# Altium project Control_Board.PrjPcb (part 3 of 7)

## Sheet Gate_Driver.SchDoc
size A4; SheetNumber: 5; SheetTotal: 9
Used 3 times, as channels GD1, GD2, GD3. Parts and nets are listed once, with the designators drawn on the sheet.
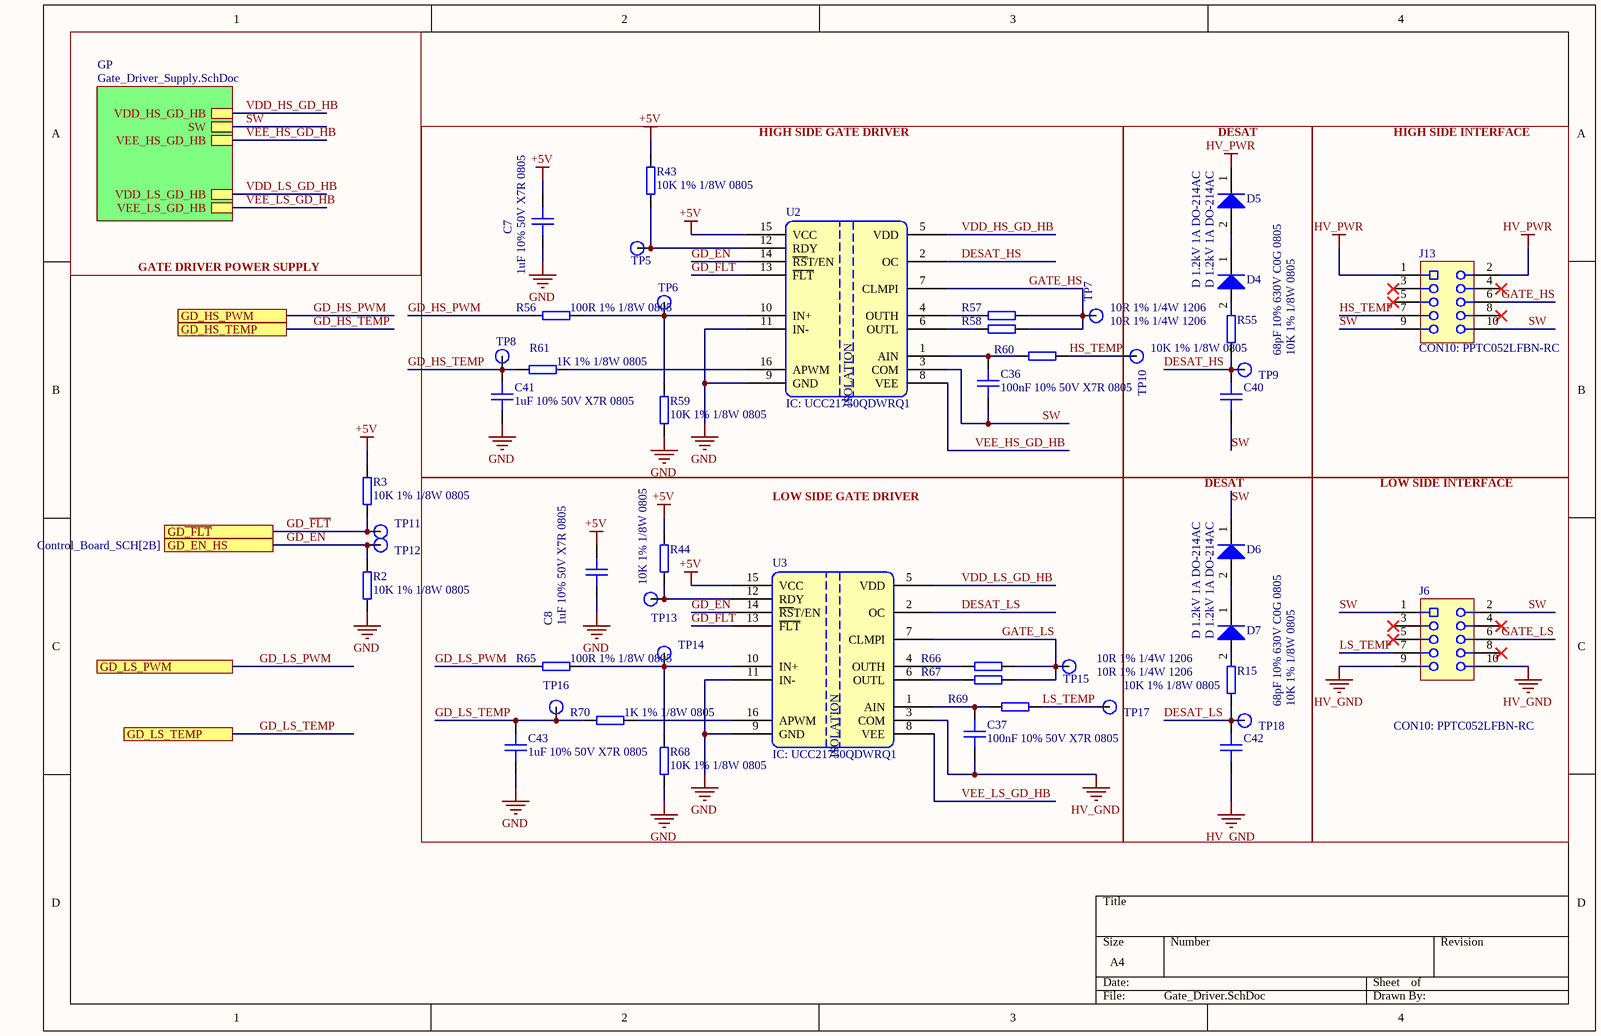
[diagram p3: Gate_Driver.SchDoc]

### Parts
C7  1uF 10% 50V X7R 0805  [CAPC2012X10N]
C8  1uF 10% 50V X7R 0805  [CAPC2012X10N]
C36  100nF 10% 50V X7R 0805  [CAPC2012X10N]
C37  100nF 10% 50V X7R 0805  [CAPC2012X10N]
C40  68pF 10% 630V C0G 0805  [CAPC2012X10N]
C41  1uF 10% 50V X7R 0805  [CAPC2012X10N]
C42  68pF 10% 630V C0G 0805  [CAPC2012X10N]
C43  1uF 10% 50V X7R 0805  [CAPC2012X10N]
D4  D 1.2kV 1A DO-214AC  [FP-95400-MFG]
D5  D 1.2kV 1A DO-214AC  [FP-95400-MFG]
D6  D 1.2kV 1A DO-214AC  [FP-95400-MFG]
D7  D 1.2kV 1A DO-214AC  [FP-95400-MFG]
J6  CON10: PPTC052LFBN-RC  [SLIN-PPTC052LFBN-RC_V]
J13  CON10: PPTC052LFBN-RC  [SLIN-PPTC052LFBN-RC_V]
R2  10K 1% 1/8W 0805  [RESC2012X05N]
R3  10K 1% 1/8W 0805  [RESC2012X05N]
R15  10K 1% 1/8W 0805  [RESC2012X05N]
R43  10K 1% 1/8W 0805  [RESC2012X05N]
R44  10K 1% 1/8W 0805  [RESC2012X05N]
R55  10K 1% 1/8W 0805  [RESC2012X05N]
R56  100R 1% 1/8W 0805  [RESC2012X05N]
R57  10R 1% 1/4W 1206  [RESC3116X06N]
R58  10R 1% 1/4W 1206  [RESC3116X06N]
R59  10K 1% 1/8W 0805  [RESC2012X05N]
R60  10K 1% 1/8W 0805  [RESC2012X05N]
R61  1K 1% 1/8W 0805  [RESC2012X05N]
R65  100R 1% 1/8W 0805  [RESC2012X05N]
R66  10R 1% 1/4W 1206  [RESC3116X06N]
R67  10R 1% 1/4W 1206  [RESC3116X06N]
R68  10K 1% 1/8W 0805  [RESC2012X05N]
R69  10K 1% 1/8W 0805  [RESC2012X05N]
R70  1K 1% 1/8W 0805  [RESC2012X05N]
TP5  TestPoint  [Test Point-Footprint-1]  (value not drawn)
TP6  TestPoint  [Test Point-Footprint-1]  (value not drawn)
TP7  TestPoint  [Test Point-Footprint-1]  (value not drawn)
TP8  TestPoint  [Test Point-Footprint-1]  (value not drawn)
TP9  TestPoint  [Test Point-Footprint-1]  (value not drawn)
TP10  TestPoint  [Test Point-Footprint-1]  (value not drawn)
TP11  TestPoint  [Test Point-Footprint-1]  (value not drawn)
TP12  TestPoint  [Test Point-Footprint-1]  (value not drawn)
TP13  TestPoint  [Test Point-Footprint-1]  (value not drawn)
TP14  TestPoint  [Test Point-Footprint-1]  (value not drawn)
TP15  TestPoint  [Test Point-Footprint-1]  (value not drawn)
TP16  TestPoint  [Test Point-Footprint-1]  (value not drawn)
TP17  TestPoint  [Test Point-Footprint-1]  (value not drawn)
TP18  TestPoint  [Test Point-Footprint-1]  (value not drawn)
U2  IC: UCC21750QDWRQ1  [SOIC127P1030X265-16N]
U3  IC: UCC21750QDWRQ1  [SOIC127P1030X265-16N]

### Blocks framed on the sheet
HIGH SIDE GATE DRIVER: C7 C36 C41 R43 R56-R61 TP5-TP8 U2
DESAT: C40 D4 D5 R55 TP9 TP10
HIGH SIDE INTERFACE: J13
LOW SIDE GATE DRIVER: C8 C37 C43 R44 R65-R70 TP13-TP17 U3
DESAT: C42 D6 D7 R15 TP18
LOW SIDE INTERFACE: J6

### Sub-sheets
GP = Gate_Driver_Supply.SchDoc: VDD_HS_GD_HB, SW, VEE_HS_GD_HB, VDD_LS_GD_HB, VEE_LS_GD_HB

### Ports
GD_EN_HS (see Control_Board_SCH[2B]), GD_HS_PWM (see Control_Board_SCH[2B]), GD_HS_TEMP (see Control_Board_SCH[2B]), GD_LS_PWM (see Control_Board_SCH[2C]), GD_LS_TEMP (see Control_Board_SCH[2C]), GD~{_FLT} (see Control_Board_SCH[2B])

### Nets
+5V: C7.2 C8.2 R3.2 R43.2 R44.2 U2.15(VCC) U3.15(VCC)
GND: C7.1 C8.1 C41.1 C43.1 R2.1 R59.1 R68.1 U2.9(GND) U2.11(IN-) U3.9(GND) U3.11(IN-)
HV_GND: C37.2 C42.1 J6.9 J6.10 U3.3(COM)
HV_PWR: D5.1(K) J13.1 J13.2
DESAT_HS: C40.2 R55.1 TP9.1 U2.2(OC)
DESAT_LS: C42.2 R15.1 TP18.1 U3.2(OC)
GATE_HS: J13.6 R57.2 R58.2 TP7.1 U2.7(CLMPI)
GATE_LS: J6.6 R66.2 R67.2 TP15.1 U3.7(CLMPI)
GD_EN: R2.2 TP12.1 U2.14(~{RS}T/EN) U3.14(~{RS}T/EN) ; port GD_EN_HS
GD_~{FLT}: R3.1 TP11.1 U2.13(~{FLT}) U3.13(~{FLT}) ; port GD~{_FLT}
GD_HS_PWM: R56.1 ; port GD_HS_PWM
GD_HS_TEMP: C41.2 R61.1 TP8.1 ; port GD_HS_TEMP
GD_LS_PWM: R65.1 ; port GD_LS_PWM
GD_LS_TEMP: C43.2 R70.1 TP16.1 ; port GD_LS_TEMP
HS_TEMP: J13.7 R60.2 TP10.1
LS_TEMP: J6.7 R69.2 TP17.1
SW: C36.2 C40.1 D6.1(K) J6.1 J6.2 J13.9 J13.10 U2.3(COM) ; sheet GP/SW
VDD_HS_GD_HB: U2.5(VDD) ; sheet GP/VDD_HS_GD_HB
VDD_LS_GD_HB: U3.5(VDD) ; sheet GP/VDD_LS_GD_HB
VEE_HS_GD_HB: U2.8(VEE) ; sheet GP/VEE_HS_GD_HB
VEE_LS_GD_HB: U3.8(VEE) ; sheet GP/VEE_LS_GD_HB
NetC36_1: C36.1 R60.1 U2.1(AIN)
NetC37_1: C37.1 R69.1 U3.1(AIN)
NetD4_1: D4.1(K) D5.2(A)
NetD4_2: D4.2(A) R55.2
NetD6_2: D6.2(A) D7.1(K)
NetD7_2: D7.2(A) R15.2
NetR43_1: R43.1 TP5.1 U2.12(RDY)
NetR44_1: R44.1 TP13.1 U3.12(RDY)
NetR56_2: R56.2 R59.2 TP6.1 U2.10(IN+)
NetR57_1: R57.1 U2.4(OUTH)
NetR58_1: R58.1 U2.6(OUTL)
NetR61_2: R61.2 U2.16(APWM)
NetR65_2: R65.2 R68.2 TP14.1 U3.10(IN+)
NetR66_1: R66.1 U3.4(OUTH)
NetR67_1: R67.1 U3.6(OUTL)
NetR70_2: R70.2 U3.16(APWM)

Not connected (* = marked no-connect by the designer): J6 3* 4* 5* 8*; J13 3* 4* 5* 8*

### Channels
GD1: designators end in _GD1; ports GD_EN_HS=GD_EN GD_HS_PWM=GD_HS_PWM GD_HS_TEMP=GD_HS_TEMP GD_LS_PWM=GD_LS_PWM GD_LS_TEMP=GD_LS_TEMP GD~{_FLT}=GD~{_FLT}1
GD2: designators end in _GD2; ports GD_EN_HS=GD_EN GD_HS_PWM=GD_HS_PWM GD_HS_TEMP=GD_HS_TEMP GD_LS_PWM=GD_LS_PWM GD_LS_TEMP=GD_LS_TEMP GD~{_FLT}=GD~{_FLT}2
GD3: designators end in _GD3; ports GD_EN_HS=GD_EN GD_HS_PWM=GD_HS_PWM GD_HS_TEMP=GD_HS_TEMP GD_LS_PWM=GD_LS_PWM GD_LS_TEMP=GD_LS_TEMP GD~{_FLT}=GD~{_FLT}3

### Notes on the sheet
- GATE DRIVER POWER SUPPLY
- (in symbol CMP-309-000001-3) ISOLATION

### Library data of the parts
C7 C8 C41 C43 = CMP-001-00047-1: Ceramic Capacitor, Multilayer, Ceramic, 50V, 10% +Tol, 10% -Tol, X7R, 15% TC, 1uF, Surface Mount, 0805; Manufacturer Part Number: C2012X7R1H105K125AB; Manufacturer Lifecycle Status: PRODUCTION; Manufacturer: TDK; Value: 1µF; Export Control Classification Number (ECCN) Code: EAR99; Case/Package: 0805; Max Length: 3.5mm; ComponentLink4Description: https://datasheet.octopart.com:443/C3216X7R1H106K160AC-TDK-datasheet-151546523.pdf?src-supplier=ODG+(Origin+Data+Global); ComponentLink1URL: https://datasheet.octopart.com:443/C3216X7R1H106K160AC-TDK-datasheet-175423548.pdf?src-supplier=TME; Category: Ceramic Capacitors; Voltage Rating (DC): 50V; Case Code (Metric): 2012; Lifecycle Status: Production; Height: 1.6mm; Design Item ID: 1uF 10% 50V X7R 0805; Min Length: 3.1mm; Min Operating Temperature: -55°C; Pricing: 100=3,09, 250=2,81, 500=2,35, 1000=2,2, 2000=1,97 (DKK); Width: 1.6mm; Voltage Rating: 50V; Stock: 26276; ComponentLink2Description: https://datasheet.octopart.com:443/C3216X7R1H106K160AC-TDK-datasheet-182135025.pdf?src-supplier=TME; Harmonized Tariff Schedule (HTS) Code: 8532.24.00.20; ComponentLink3Description: https://datasheet.octopart.com:443/C3216X7R1H106K160AC-TDK-datasheet-159617022.pdf?src-supplier=TME; Thickness: 1.6mm; Max Operating Temperature: 125°C; ComponentLink4URL: https://datasheet.octopart.com:443/C3216X7R1H106K160AC-TDK-datasheet-151546523.pdf?src-supplier=ODG+(Origin+Data+Global); Lead Free: Lead Free; ComponentLink3URL: https://datasheet.octopart.com:443/C3216X7R1H106K160AC-TDK-datasheet-159617022.pdf?src-supplier=TME; ComponentLink1Description: https://datasheet.octopart.com:443/C3216X7R1H106K160AC-TDK-datasheet-175423548.pdf?src-supplier=TME; Max Width: 1.9mm; Dielectric: X7R; RoHS: Compliant; China RoHS: Compliant; REACH SVHC: Yes; ComponentLink2URL: https://datasheet.octopart.com:443/C3216X7R1H106K160AC-TDK-datasheet-182135025.pdf?src-supplier=TME; Length: 3.2mm; ComponentLink5URL: https://datasheet.octopart.com/C3216X7R1H106K160AC-TDK-datasheet-41194876.pdf; Introduction Date: 2018-03-29; Dielectric Material: Ceramic; Min Width: 1.5mm; Number of Terminals: 2; Material: Ceramic; Source: MasterLibrary_SCH.SchLib; Mounting Technology: Surface Mount; ComponentLink5Description: https://datasheet.octopart.com/C3216X7R1H106K160AC-TDK-datasheet-41194876.pdf
C36 C37 = CMP-001-00091-1: Multilayer Ceramic Capacitors MLCC - SMD/SMT 50V 0.1uF X7R 0805 10%; Manufacturer: Stackpole Electronics; Manufacturer Part Number: CML0805X7R104KT50V; Voltage Rating (DC): 50V; REACH SVHC: Yes; Height: 800µm; Min Operating Temperature: -55°C; Dielectric Material: Ceramic; RoHS: Compliant; Number of Terminals: 2; Lifecycle Status: Production; Width: 1.25mm; Length: 2mm; Category: Ceramic Capacitors; Max Operating Temperature: 125°C; Mount: Surface Mount; Capacitance: 100nF
C40 C42 = CMP-001-00086-1: Ceramic Capacitor, Multilayer, Ceramic, 630V, 5% +Tol, 5% -Tol, C0G, 30ppm/Cel TC, 6.8e-05uF, Surface Mount, 0805; Manufacturer: KEMET; Manufacturer Part Number: C0805C680JBGACTU; Introduction Date: 2008-11-25; Value: 68pF; Length: 2mm; Max Operating Temperature: 125°C; Number of Terminals: 2; Lifecycle Status: Production; ComponentLink4URL: https://datasheet.octopart.com/C0805C680JBGACTU-KEMET-datasheet-84169754.pdf; RoHS: Compliant; Stock: 677; Dielectric Material: Ceramic; Voltage Rating (DC): 630V; ComponentLink2Description: https://datasheet.octopart.com:443/C0805C680JBGACTU-KEMET-datasheet-149535597.pdf?src-supplier=Farnell; Pricing: 1=0,53, 10=0,35, 50=0,35, 100=0,218, 1000=0,159, 10000=0,122 (USD); ComponentLink3Description: https://datasheet.octopart.com:443/C0805C680JBGACTU-KEMET-datasheet-182914728.pdf?src-supplier=Farnell; Source: MasterLibrary_SCH.SchLib; ComponentLink4Description: https://datasheet.octopart.com/C0805C680JBGACTU-KEMET-datasheet-84169754.pdf; Case Code (Metric): 2012; Voltage Rating: 630V; ComponentLink1URL: https://datasheet.octopart.com:443/C0805C680JBGACTU-KEMET-datasheet-182037878.pdf?src-supplier=IHS; ComponentLink1Description: https://datasheet.octopart.com:443/C0805C680JBGACTU-KEMET-datasheet-182037878.pdf?src-supplier=IHS; Country of Origin: Mexico; Export Control Classification Number (ECCN) Code: EAR99; Width: 1.25mm; Design Item ID: 68pF 10% 630V C0G 0805; Height: 1.25mm; Case/Package: 0805; REACH SVHC: Yes; Mounting Technology: Surface Mount; Harmonized Tariff Schedule (HTS) Code: 8532.24.00.20; Dielectric: C0G; Min Operating Temperature: -55°C; Termination: SMD/SMT; Lead Free: Lead Free; Category: Ceramic Capacitors; ComponentLink3URL: https://datasheet.octopart.com:443/C0805C680JBGACTU-KEMET-datasheet-182914728.pdf?src-supplier=Farnell; ComponentLink2URL: https://datasheet.octopart.com:443/C0805C680JBGACTU-KEMET-datasheet-149535597.pdf?src-supplier=Farnell; Tolerance: 5%; China RoHS: Compliant
D4-D7 = CMP-001-00088-2: Rectifier Diode, 1 Phase, 1 Element, 1A, 1000V V(RRM), Silicon, DO-214AC; Manufacturer: Vishay; Manufacturer Part Number: US1M-E3/61T; Max Surge Current: 30A; Max Junction Temperature (Tj): 150°C; Value: 10pF; Voltage Rating (DC): 1kV; Number of Elements: 1; Reverse Recovery Time: 75ns; Polarity: Standard; Peak Reverse Current: 10µA; Element Configuration: Single; Forward Voltage: 1.7V; Min Operating Temperature: -55°C; Output Current: 1A; Schedule B: 8541100080, 8541100080; Lead Free: Lead Free; Reverse Voltage: 1kV; Current: 1A; Min Breakdown Voltage: 1kV; Termination: SMD/SMT; Case/Package: SMA; Lifecycle Status: Production; Voltage: 1kV; Length: 4.5mm; Height: 2.29mm; Pins: 2; Number of Terminals: 2; Current Rating: 1A; Width: 4.5mm; Reverse Standoff Voltage: 1kV; Packaging: Cut Tape; Forward Current: 1A; China RoHS: Non-Compliant; Max Reverse Voltage (DC): 1kV; Recovery Time: 75ns; Mounting Technology: Surface Mount; Max Forward Surge Current (Ifsm): 30A; Average Rectified Current: 1A; Max Operating Temperature: 150°C; RoHS: Compliant; Max Output current: 1A; Peak Non-Repetitive Surge Current: 30A; Max Repetitive Reverse Voltage (Vrrm): 1kV; REACH SVHC: No
J6 J13 = CMP-002-00579-3: Female, 10C, Straight, .100"CC; 3.20mm Tail, No Mt. 100u" Tin; PBT, Phos Bronze, 105 C; Manufacturer: Sullins; Number of Positions: 10; Dielectric Material: Polyester; Connector Type: Header, Socket; Row Spacing: 2.54mm; Current Rating: 3A; Lifecycle Status: Production; REACH SVHC: Yes; Contact Material: Bronze; Terminal Pitch: 2.54mm; Number of Rows: 2; Packaging: Bulk; Contact Plating: Tin; RoHS: Compliant; Color: Black; Max Operating Temperature: 105°C; Manufacturer Part Number: PPTC052LFBN-RC; Number of Pins: 10; Pitch: 2.54mm; Min Operating Temperature: -40°C; Housing Material: Plastic; Mount: Through Hole; Category: Card Edge Connectors; Length: 13.2mm; Height: 8.5mm; Lead Free: Lead Free; Contact Gender: Female
R2 R3 R43 R44 R59 R68 = CMP-009-00659-2: Res Thick Film 0805 10K Ohm 1% 0.125W ±100ppm/°C Molded SMD Paper T/R; Manufacturer Part Number: RMCF0805FT10K0; Manufacturer: Stackpole Electronics; Power Rating: 125mW; Voltage Rating: 150V; RoHS: Compliant; ComponentLink5URL: https://datasheet.octopart.com:443/RMCF0805FT10K0-Stackpole-Electronics-datasheet-141193804.pdf?src-supplier=Stackpole+Electronics; ComponentLink5Description: https://datasheet.octopart.com:443/RMCF0805FT10K0-Stackpole-Electronics-datasheet-141193804.pdf?src-supplier=Stackpole+Electronics; ComponentLink3Description: https://datasheet.octopart.com:443/RMCF0805FT10K0-Stackpole-Electronics-datasheet-28504820.pdf?src-supplier=Upverter; Case Code (Metric): 2012; Contact Plating: Tin; Temperature Coefficient: 100ppm/°C; Power Dissipation: 125mW; ComponentLink11URL: https://datasheet.octopart.com:443/RMCF0805FT10K0-Stackpole-Electronics-datasheet-8359789.pdf?src-supplier=Future+Electronics; ComponentLink9Description: https://datasheet.octopart.com:443/RMCF0805FT10K0-Stackpole-Electronics-datasheet-11546843.pdf?src-supplier=Arrow+Electronics; ComponentLink13URL: https://datasheet.octopart.com:443/RMCF0805FT10K0-Stackpole-Electronics-datasheet-8088878.pdf?src-supplier=Future+Electronics; China RoHS: Non-Compliant; Height: 500µm; Composition: Thick Film; Case/Package: 0805; ComponentLink4URL: https://datasheet.octopart.com:443/RMCF0805FT10K0-Stackpole-Electronics-datasheet-12510902.pdf?src-supplier=Upverter; ComponentLink6Description: https://datasheet.octopart.com:443/RMCF0805FT10K0-Stackpole-Electronics-datasheet-62091608.pdf?src-supplier=Stackpole+Electronics; Schedule B: 8533210045, 8533210045; ComponentLink7Description: https://datasheet.octopart.com:443/RMCF0805FT10K0-Stackpole-Electronics-datasheet-10788263.pdf?src-supplier=Stackpole+Electronics; ComponentLink12URL: https://datasheet.octopart.com:443/RMCF0805FT10K0-Stackpole-Electronics-datasheet-8324226.pdf?src-supplier=Future+Electronics; Military Standard: Not; Max Operating Temperature: 155°C; Lifecycle Status: Production; Design Item ID: 10K 1% 1/4W 0805; ComponentLink2URL: https://datasheet.octopart.com:443/RMCF0805FT10K0-Stackpole-Electronics-datasheet-12534581.pdf?src-supplier=Upverter; ComponentLink6URL: https://datasheet.octopart.com:443/RMCF0805FT10K0-Stackpole-Electronics-datasheet-62091608.pdf?src-supplier=Stackpole+Electronics; ComponentLink3URL: https://datasheet.octopart.com:443/RMCF0805FT10K0-Stackpole-Electronics-datasheet-28504820.pdf?src-supplier=Upverter; ComponentLink13Description: https://datasheet.octopart.com:443/RMCF0805FT10K0-Stackpole-Electronics-datasheet-8088878.pdf?src-supplier=Future+Electronics; Source: MasterLibrary_SCH.SchLib; Length: 2mm; ComponentLink2Description: https://datasheet.octopart.com:443/RMCF0805FT10K0-Stackpole-Electronics-datasheet-12534581.pdf?src-supplier=Upverter; Max Power Dissipation: 125mW; REACH SVHC: Yes; ComponentLink17URL: http://sigma.octopart.com:80/141158212/rohs_statement/Stackpole-Electronics-RMCF0805FT10K0.pdf?src-supplier=Compliance+Statements; ComponentLink15URL: http://sigma.octopart.com:80/15940719/materials_sheet/Stackpole-Electronics-RMCF0805FT10K0.pdf?src-supplier=Compliance+Statements; Radiation Hardening: No; ComponentLink10URL: https://datasheet.octopart.com:443/RMCF0805FT10K0-Stackpole-Electronics-datasheet-11547379.pdf?src-supplier=Future+Electronics; Stock: 3420000; Working Voltage: 150V; Pricing: 5000=0.00245, 10000=0.00241, 20000=0.00238, 40000=0.00234, 80000=0.0023 (USD); Mounting Technology: Surface Mount; Depth: 1.25mm; ComponentLink9URL: https://datasheet.octopart.com:443/RMCF0805FT10K0-Stackpole-Electronics-datasheet-11546843.pdf?src-supplier=Arrow+Electronics; ComponentLink11Description: https://datasheet.octopart.com:443/RMCF0805FT10K0-Stackpole-Electronics-datasheet-8359789.pdf?src-supplier=Future+Electronics; ComponentLink15Description: http://sigma.octopart.com:80/15940719/materials_sheet/Stackpole-Electronics-RMCF0805FT10K0.pdf?src-supplier=Compliance+Statements; ComponentLink16Description: http://sigma.octopart.com:80/141158211/reach_statement/Stackpole-Electronics-RMCF0805FT10K0.pdf?src-supplier=Compliance+Statements; ComponentLink17Description: http://sigma.octopart.com:80/141158212/rohs_statement/Stackpole-Electronics-RMCF0805FT10K0.pdf?src-supplier=Compliance+Statements; Min Operating Temperature: -55°C; ComponentLink10Description: https://datasheet.octopart.com:443/RMCF0805FT10K0-Stackpole-Electronics-datasheet-11547379.pdf?src-supplier=Future+Electronics; Width: 1.25mm; Number of Terminals: 2; ComponentLink7URL: https://datasheet.octopart.com:443/RMCF0805FT10K0-Stackpole-Electronics-datasheet-10788263.pdf?src-supplier=Stackpole+Electronics; Lead Free: Lead Free; ComponentLink8URL: https://datasheet.octopart.com:443/RMCF0805FT10K0-Stackpole-Electronics-datasheet-154799224.pdf?src-supplier=Master+Electronics; ComponentLink14Description: https://datasheet.octopart.com:443/RMCF0805FT10K0-Stackpole-Electronics-datasheet-5313682.pdf?src-supplier=Future+Electronics; ComponentLink12Description: https://datasheet.octopart.com:443/RMCF0805FT10K0-Stackpole-Electronics-datasheet-8324226.pdf?src-supplier=Future+Electronics; ComponentLink1URL: https://datasheet.octopart.com:443/RMCF0805FT10K0-Stackpole-Electronics-datasheet-182148065.pdf?src-supplier=IHS; Packaging: Cut Tape (CT); Value: 10k; Features: Automotive AEC-Q200; ComponentLink14URL: https://datasheet.octopart.com:443/RMCF0805FT10K0-Stackpole-Electronics-datasheet-5313682.pdf?src-supplier=Future+Electronics; Number of Terminations: 2; Category: Chip SMD Resistors; ComponentLink16URL: http://sigma.octopart.com:80/141158211/reach_statement/Stackpole-Electronics-RMCF0805FT10K0.pdf?src-supplier=Compliance+Statements; Tolerance: 1%; ComponentLink4Description: https://datasheet.octopart.com:443/RMCF0805FT10K0-Stackpole-Electronics-datasheet-12510902.pdf?src-supplier=Upverter; ComponentLink8Description: https://datasheet.octopart.com:443/RMCF0805FT10K0-Stackpole-Electronics-datasheet-154799224.pdf?src-supplier=Master+Electronics; ComponentLink1Description: https://datasheet.octopart.com:443/RMCF0805FT10K0-Stackpole-Electronics-datasheet-182148065.pdf?src-supplier=IHS
R15 R55 R60 R69 = CMP-009-00659-2: Res Thick Film 0805 10K Ohm 1% 0.125W ±100ppm/°C Molded SMD Paper T/R; Manufacturer Part Number: RMCF0805FT10K0; Manufacturer: Stackpole Electronics; Power Rating: 125mW; Working Voltage: 150V; ComponentLink17Description: http://sigma.octopart.com:80/141158212/rohs_statement/Stackpole-Electronics-RMCF0805FT10K0.pdf?src-supplier=Compliance+Statements; Military Standard: Not; ComponentLink2Description: https://datasheet.octopart.com:443/RMCF0805FT10K0-Stackpole-Electronics-datasheet-12534581.pdf?src-supplier=Upverter; Power Dissipation: 125mW; Radiation Hardening: No; Min Operating Temperature: -55°C; Mounting Technology: Surface Mount; Pricing: 5000=0.00245, 10000=0.00241, 20000=0.00238, 40000=0.00234, 80000=0.0023 (USD); ComponentLink9Description: https://datasheet.octopart.com:443/RMCF0805FT10K0-Stackpole-Electronics-datasheet-11546843.pdf?src-supplier=Arrow+Electronics; Temperature Coefficient: 100ppm/°C; Contact Plating: Tin; Number of Terminals: 2; Source: MasterLibrary_SCH.SchLib; ComponentLink16URL: http://sigma.octopart.com:80/141158211/reach_statement/Stackpole-Electronics-RMCF0805FT10K0.pdf?src-supplier=Compliance+Statements; ComponentLink10Description: https://datasheet.octopart.com:443/RMCF0805FT10K0-Stackpole-Electronics-datasheet-11547379.pdf?src-supplier=Future+Electronics; Case/Package: 0805; RoHS: Compliant; ComponentLink14Description: https://datasheet.octopart.com:443/RMCF0805FT10K0-Stackpole-Electronics-datasheet-5313682.pdf?src-supplier=Future+Electronics; Max Power Dissipation: 125mW; ComponentLink7URL: https://datasheet.octopart.com:443/RMCF0805FT10K0-Stackpole-Electronics-datasheet-10788263.pdf?src-supplier=Stackpole+Electronics; Number of Terminations: 2; Tolerance: 1%; Stock: 3420000; ComponentLink3Description: https://datasheet.octopart.com:443/RMCF0805FT10K0-Stackpole-Electronics-datasheet-28504820.pdf?src-supplier=Upverter; REACH SVHC: Yes; ComponentLink7Description: https://datasheet.octopart.com:443/RMCF0805FT10K0-Stackpole-Electronics-datasheet-10788263.pdf?src-supplier=Stackpole+Electronics; ComponentLink4URL: https://datasheet.octopart.com:443/RMCF0805FT10K0-Stackpole-Electronics-datasheet-12510902.pdf?src-supplier=Upverter; Max Operating Temperature: 155°C; Voltage Rating: 150V; ComponentLink9URL: https://datasheet.octopart.com:443/RMCF0805FT10K0-Stackpole-Electronics-datasheet-11546843.pdf?src-supplier=Arrow+Electronics; ComponentLink5URL: https://datasheet.octopart.com:443/RMCF0805FT10K0-Stackpole-Electronics-datasheet-141193804.pdf?src-supplier=Stackpole+Electronics; ComponentLink12URL: https://datasheet.octopart.com:443/RMCF0805FT10K0-Stackpole-Electronics-datasheet-8324226.pdf?src-supplier=Future+Electronics; ComponentLink4Description: https://datasheet.octopart.com:443/RMCF0805FT10K0-Stackpole-Electronics-datasheet-12510902.pdf?src-supplier=Upverter; ComponentLink14URL: https://datasheet.octopart.com:443/RMCF0805FT10K0-Stackpole-Electronics-datasheet-5313682.pdf?src-supplier=Future+Electronics; ComponentLink15URL: http://sigma.octopart.com:80/15940719/materials_sheet/Stackpole-Electronics-RMCF0805FT10K0.pdf?src-supplier=Compliance+Statements; Category: Chip SMD Resistors; Value: 10k; ComponentLink2URL: https://datasheet.octopart.com:443/RMCF0805FT10K0-Stackpole-Electronics-datasheet-12534581.pdf?src-supplier=Upverter; Packaging: Cut Tape (CT); ComponentLink8Description: https://datasheet.octopart.com:443/RMCF0805FT10K0-Stackpole-Electronics-datasheet-154799224.pdf?src-supplier=Master+Electronics; Composition: Thick Film; Height: 500µm; ComponentLink17URL: http://sigma.octopart.com:80/141158212/rohs_statement/Stackpole-Electronics-RMCF0805FT10K0.pdf?src-supplier=Compliance+Statements; ComponentLink6Description: https://datasheet.octopart.com:443/RMCF0805FT10K0-Stackpole-Electronics-datasheet-62091608.pdf?src-supplier=Stackpole+Electronics; ComponentLink11Description: https://datasheet.octopart.com:443/RMCF0805FT10K0-Stackpole-Electronics-datasheet-8359789.pdf?src-supplier=Future+Electronics; ComponentLink10URL: https://datasheet.octopart.com:443/RMCF0805FT10K0-Stackpole-Electronics-datasheet-11547379.pdf?src-supplier=Future+Electronics; ComponentLink1URL: https://datasheet.octopart.com:443/RMCF0805FT10K0-Stackpole-Electronics-datasheet-182148065.pdf?src-supplier=IHS; Features: Automotive AEC-Q200; Width: 1.25mm; ComponentLink13Description: https://datasheet.octopart.com:443/RMCF0805FT10K0-Stackpole-Electronics-datasheet-8088878.pdf?src-supplier=Future+Electronics; ComponentLink12Description: https://datasheet.octopart.com:443/RMCF0805FT10K0-Stackpole-Electronics-datasheet-8324226.pdf?src-supplier=Future+Electronics; ComponentLink3URL: https://datasheet.octopart.com:443/RMCF0805FT10K0-Stackpole-Electronics-datasheet-28504820.pdf?src-supplier=Upverter; ComponentLink8URL: https://datasheet.octopart.com:443/RMCF0805FT10K0-Stackpole-Electronics-datasheet-154799224.pdf?src-supplier=Master+Electronics; ComponentLink13URL: https://datasheet.octopart.com:443/RMCF0805FT10K0-Stackpole-Electronics-datasheet-8088878.pdf?src-supplier=Future+Electronics; Lifecycle Status: Production; China RoHS: Non-Compliant; Schedule B: 8533210045, 8533210045; Lead Free: Lead Free; ComponentLink6URL: https://datasheet.octopart.com:443/RMCF0805FT10K0-Stackpole-Electronics-datasheet-62091608.pdf?src-supplier=Stackpole+Electronics; ComponentLink5Description: https://datasheet.octopart.com:443/RMCF0805FT10K0-Stackpole-Electronics-datasheet-141193804.pdf?src-supplier=Stackpole+Electronics; Case Code (Metric): 2012; ComponentLink15Description: http://sigma.octopart.com:80/15940719/materials_sheet/Stackpole-Electronics-RMCF0805FT10K0.pdf?src-supplier=Compliance+Statements; Depth: 1.25mm; ComponentLink11URL: https://datasheet.octopart.com:443/RMCF0805FT10K0-Stackpole-Electronics-datasheet-8359789.pdf?src-supplier=Future+Electronics; ComponentLink1Description: https://datasheet.octopart.com:443/RMCF0805FT10K0-Stackpole-Electronics-datasheet-182148065.pdf?src-supplier=IHS; Length: 2mm; Design Item ID: 10K 1% 1/4W 0805; ComponentLink16Description: http://sigma.octopart.com:80/141158211/reach_statement/Stackpole-Electronics-RMCF0805FT10K0.pdf?src-supplier=Compliance+Statements
R56 R65 = CMP-009-00668-1: Res Thick Film 0805 100 Ohm 1% 0.125W ±100ppm/°C Molded SMD Paper T/R; Manufacturer Part Number: RMCF0805FT100R; Manufacturer: Stackpole Electronics; Working Voltage: 150V; Power Rating: 125mW; Value: 100; Features: Automotive AEC-Q200; Lifecycle Status: Production; ComponentLink10URL: https://datasheet.octopart.com:443/RMCF0805FT10K0-Stackpole-Electronics-datasheet-11547379.pdf?src-supplier=Future+Electronics; Case Code (Metric): 2012; ComponentLink16URL: http://sigma.octopart.com:80/141158211/reach_statement/Stackpole-Electronics-RMCF0805FT10K0.pdf?src-supplier=Compliance+Statements; ComponentLink14URL: https://datasheet.octopart.com:443/RMCF0805FT10K0-Stackpole-Electronics-datasheet-5313682.pdf?src-supplier=Future+Electronics; ComponentLink6URL: https://datasheet.octopart.com:443/RMCF0805FT10K0-Stackpole-Electronics-datasheet-62091608.pdf?src-supplier=Stackpole+Electronics; ComponentLink3URL: https://datasheet.octopart.com:443/RMCF0805FT10K0-Stackpole-Electronics-datasheet-28504820.pdf?src-supplier=Upverter; Design Item ID: 100R 1% 1/8W 0805; Mounting Technology: Surface Mount; ComponentLink9URL: https://datasheet.octopart.com:443/RMCF0805FT10K0-Stackpole-Electronics-datasheet-11546843.pdf?src-supplier=Arrow+Electronics; ComponentLink2Description: https://datasheet.octopart.com:443/RMCF0805FT10K0-Stackpole-Electronics-datasheet-12534581.pdf?src-supplier=Upverter; Voltage Rating: 150V; ComponentLink17Description: http://sigma.octopart.com:80/141158212/rohs_statement/Stackpole-Electronics-RMCF0805FT10K0.pdf?src-supplier=Compliance+Statements; Stock: 3420000; Number of Terminations: 2; Contact Plating: Tin; ComponentLink1Description: https://datasheet.octopart.com:443/RMCF0805FT10K0-Stackpole-Electronics-datasheet-182148065.pdf?src-supplier=IHS; ComponentLink2URL: https://datasheet.octopart.com:443/RMCF0805FT10K0-Stackpole-Electronics-datasheet-12534581.pdf?src-supplier=Upverter; Source: MasterLibrary_SCH.SchLib; Length: 2mm; ComponentLink13Description: https://datasheet.octopart.com:443/RMCF0805FT10K0-Stackpole-Electronics-datasheet-8088878.pdf?src-supplier=Future+Electronics; Lead Free: Lead Free; Category: Chip SMD Resistors; Composition: Thick Film; Tolerance: 1%; Schedule B: 8533210045, 8533210045; RoHS: Compliant; ComponentLink15URL: http://sigma.octopart.com:80/15940719/materials_sheet/Stackpole-Electronics-RMCF0805FT10K0.pdf?src-supplier=Compliance+Statements; Case/Package: 0805; Pricing: 5000=0.00245, 10000=0.00241, 20000=0.00238, 40000=0.00234, 80000=0.0023 (USD); ComponentLink8Description: https://datasheet.octopart.com:443/RMCF0805FT10K0-Stackpole-Electronics-datasheet-154799224.pdf?src-supplier=Master+Electronics; ComponentLink11Description: https://datasheet.octopart.com:443/RMCF0805FT10K0-Stackpole-Electronics-datasheet-8359789.pdf?src-supplier=Future+Electronics; China RoHS: Non-Compliant; Height: 500µm; ComponentLink9Description: https://datasheet.octopart.com:443/RMCF0805FT10K0-Stackpole-Electronics-datasheet-11546843.pdf?src-supplier=Arrow+Electronics; ComponentLink8URL: https://datasheet.octopart.com:443/RMCF0805FT10K0-Stackpole-Electronics-datasheet-154799224.pdf?src-supplier=Master+Electronics; ComponentLink12Description: https://datasheet.octopart.com:443/RMCF0805FT10K0-Stackpole-Electronics-datasheet-8324226.pdf?src-supplier=Future+Electronics; Temperature Coefficient: 100ppm/°C; ComponentLink12URL: https://datasheet.octopart.com:443/RMCF0805FT10K0-Stackpole-Electronics-datasheet-8324226.pdf?src-supplier=Future+Electronics; Number of Terminals: 2; Depth: 1.25mm; ComponentLink7Description: https://datasheet.octopart.com:443/RMCF0805FT10K0-Stackpole-Electronics-datasheet-10788263.pdf?src-supplier=Stackpole+Electronics; ComponentLink15Description: http://sigma.octopart.com:80/15940719/materials_sheet/Stackpole-Electronics-RMCF0805FT10K0.pdf?src-supplier=Compliance+Statements; ComponentLink6Description: https://datasheet.octopart.com:443/RMCF0805FT10K0-Stackpole-Electronics-datasheet-62091608.pdf?src-supplier=Stackpole+Electronics; Packaging: Cut Tape (CT); Max Operating Temperature: 155°C; ComponentLink7URL: https://datasheet.octopart.com:443/RMCF0805FT10K0-Stackpole-Electronics-datasheet-10788263.pdf?src-supplier=Stackpole+Electronics; ComponentLink16Description: http://sigma.octopart.com:80/141158211/reach_statement/Stackpole-Electronics-RMCF0805FT10K0.pdf?src-supplier=Compliance+Statements; Width: 1.25mm; Power Dissipation: 125mW; ComponentLink5Description: https://datasheet.octopart.com:443/RMCF0805FT10K0-Stackpole-Electronics-datasheet-141193804.pdf?src-supplier=Stackpole+Electronics; Radiation Hardening: No; Military Standard: Not; Min Operating Temperature: -55°C; ComponentLink11URL: https://datasheet.octopart.com:443/RMCF0805FT10K0-Stackpole-Electronics-datasheet-8359789.pdf?src-supplier=Future+Electronics; ComponentLink3Description: https://datasheet.octopart.com:443/RMCF0805FT10K0-Stackpole-Electronics-datasheet-28504820.pdf?src-supplier=Upverter; REACH SVHC: Yes; ComponentLink4Description: https://datasheet.octopart.com:443/RMCF0805FT10K0-Stackpole-Electronics-datasheet-12510902.pdf?src-supplier=Upverter; ComponentLink10Description: https://datasheet.octopart.com:443/RMCF0805FT10K0-Stackpole-Electronics-datasheet-11547379.pdf?src-supplier=Future+Electronics; ComponentLink5URL: https://datasheet.octopart.com:443/RMCF0805FT10K0-Stackpole-Electronics-datasheet-141193804.pdf?src-supplier=Stackpole+Electronics; Max Power Dissipation: 125mW; ComponentLink13URL: https://datasheet.octopart.com:443/RMCF0805FT10K0-Stackpole-Electronics-datasheet-8088878.pdf?src-supplier=Future+Electronics; ComponentLink17URL: http://sigma.octopart.com:80/141158212/rohs_statement/Stackpole-Electronics-RMCF0805FT10K0.pdf?src-supplier=Compliance+Statements; ComponentLink14Description: https://datasheet.octopart.com:443/RMCF0805FT10K0-Stackpole-Electronics-datasheet-5313682.pdf?src-supplier=Future+Electronics; ComponentLink4URL: https://datasheet.octopart.com:443/RMCF0805FT10K0-Stackpole-Electronics-datasheet-12510902.pdf?src-supplier=Upverter; ComponentLink1URL: https://datasheet.octopart.com:443/RMCF0805FT10K0-Stackpole-Electronics-datasheet-182148065.pdf?src-supplier=IHS
R57 R58 R66 R67 = CMP-009-00661-1: Res Thick Film 1206 10 Ohm 1% 0.25W(1/4W) ±100ppm/C Pad SMD T/R Automotive AEC-Q200; Manufacturer Part Number: RMCF1206FT10R0; Manufacturer: Stackpole Electronics; Value: 10; Max Power Dissipation: 125mW; Working Voltage: 150V; Temperature Coefficient: 100ppm/°C; ComponentLink7URL: https://datasheet.octopart.com:443/RMCF0805FT10K0-Stackpole-Electronics-datasheet-10788263.pdf?src-supplier=Stackpole+Electronics; ComponentLink16Description: http://sigma.octopart.com:80/141158211/reach_statement/Stackpole-Electronics-RMCF0805FT10K0.pdf?src-supplier=Compliance+Statements; Source: MasterLibrary_SCH.SchLib; ComponentLink15URL: http://sigma.octopart.com:80/15940719/materials_sheet/Stackpole-Electronics-RMCF0805FT10K0.pdf?src-supplier=Compliance+Statements; Height: 500µm; Width: 1.25mm; Lead Free: Lead Free; ComponentLink3Description: https://datasheet.octopart.com:443/RMCF0805FT10K0-Stackpole-Electronics-datasheet-28504820.pdf?src-supplier=Upverter; ComponentLink27Description: https://datasheet.octopart.com:443/RMCF1206FT10K0-Stackpole-Electronics-datasheet-11547379.pdf?src-supplier=Future+Electronics; Features: Automotive AEC-Q200; Contact Plating: Tin; ComponentLink20URL: https://datasheet.octopart.com:443/RMCF1206FT10K0-Stackpole-Electronics-datasheet-189104163.pdf?src-supplier=Master+Electronics; Max Operating Temperature: 155°C; ComponentLink19URL: https://datasheet.octopart.com:443/RMCF1206FT10K0-Stackpole-Electronics-datasheet-141193804.pdf?src-supplier=Master+Electronics; ComponentLink25URL: https://datasheet.octopart.com:443/RMCF1206FT10K0-Stackpole-Electronics-datasheet-10788263.pdf?src-supplier=Stackpole+Electronics; ComponentLink12Description: https://datasheet.octopart.com:443/RMCF0805FT10K0-Stackpole-Electronics-datasheet-8324226.pdf?src-supplier=Future+Electronics; ComponentLink11Description: https://datasheet.octopart.com:443/RMCF0805FT10K0-Stackpole-Electronics-datasheet-8359789.pdf?src-supplier=Future+Electronics; ComponentLink8URL: https://datasheet.octopart.com:443/RMCF0805FT10K0-Stackpole-Electronics-datasheet-154799224.pdf?src-supplier=Master+Electronics; Lifecycle Status: Production; Depth: 1.25mm; ComponentLink17URL: http://sigma.octopart.com:80/141158212/rohs_statement/Stackpole-Electronics-RMCF0805FT10K0.pdf?src-supplier=Compliance+Statements; Length: 2mm; ComponentLink30URL: http://sigma.octopart.com:80/15940719/materials_sheet/Stackpole-Electronics-RMCF1206FT10K0.pdf?src-supplier=Compliance+Statements; ComponentLink29URL: https://datasheet.octopart.com:443/RMCF1206FT10K0-Stackpole-Electronics-datasheet-8324226.pdf?src-supplier=Future+Electronics; ComponentLink3URL: https://datasheet.octopart.com:443/RMCF0805FT10K0-Stackpole-Electronics-datasheet-28504820.pdf?src-supplier=Upverter; ComponentLink15Description: http://sigma.octopart.com:80/15940719/materials_sheet/Stackpole-Electronics-RMCF0805FT10K0.pdf?src-supplier=Compliance+Statements; ComponentLink7Description: https://datasheet.octopart.com:443/RMCF0805FT10K0-Stackpole-Electronics-datasheet-10788263.pdf?src-supplier=Stackpole+Electronics; ComponentLink20Description: https://datasheet.octopart.com:443/RMCF1206FT10K0-Stackpole-Electronics-datasheet-189104163.pdf?src-supplier=Master+Electronics; Packaging: Cut Tape (CT); ComponentLink31Description: http://sigma.octopart.com:80/141158212/rohs_statement/Stackpole-Electronics-RMCF1206FT10K0.pdf?src-supplier=Compliance+Statements; ComponentLink22Description: https://datasheet.octopart.com:443/RMCF1206FT10K0-Stackpole-Electronics-datasheet-62091608.pdf?src-supplier=Upverter; ComponentLink21Description: https://datasheet.octopart.com:443/RMCF1206FT10K0-Stackpole-Electronics-datasheet-116606903.pdf?src-supplier=Master+Electronics; Case Code (Metric): 3216; ComponentLink26Description: https://datasheet.octopart.com:443/RMCF1206FT10K0-Stackpole-Electronics-datasheet-11546843.pdf?src-supplier=Arrow+Electronics; ComponentLink18URL: https://datasheet.octopart.com:443/RMCF1206FT10K0-Stackpole-Electronics-datasheet-182148065.pdf?src-supplier=IHS; Schedule B: 8533210045, 8533210045; Number of Terminations: 2; Composition: Thick Film; ComponentLink11URL: https://datasheet.octopart.com:443/RMCF0805FT10K0-Stackpole-Electronics-datasheet-8359789.pdf?src-supplier=Future+Electronics; ComponentLink5URL: https://datasheet.octopart.com:443/RMCF0805FT10K0-Stackpole-Electronics-datasheet-141193804.pdf?src-supplier=Stackpole+Electronics; ComponentLink4Description: https://datasheet.octopart.com:443/RMCF0805FT10K0-Stackpole-Electronics-datasheet-12510902.pdf?src-supplier=Upverter; ComponentLink28Description: https://datasheet.octopart.com:443/RMCF1206FT10K0-Stackpole-Electronics-datasheet-8359789.pdf?src-supplier=Future+Electronics; ComponentLink14URL: https://datasheet.octopart.com:443/RMCF0805FT10K0-Stackpole-Electronics-datasheet-5313682.pdf?src-supplier=Future+Electronics; ComponentLink16URL: http://sigma.octopart.com:80/141158211/reach_statement/Stackpole-Electronics-RMCF0805FT10K0.pdf?src-supplier=Compliance+Statements; ComponentLink21URL: https://datasheet.octopart.com:443/RMCF1206FT10K0-Stackpole-Electronics-datasheet-116606903.pdf?src-supplier=Master+Electronics; ComponentLink22URL: https://datasheet.octopart.com:443/RMCF1206FT10K0-Stackpole-Electronics-datasheet-62091608.pdf?src-supplier=Upverter; ComponentLink6Description: https://datasheet.octopart.com:443/RMCF0805FT10K0-Stackpole-Electronics-datasheet-62091608.pdf?src-supplier=Stackpole+Electronics; ComponentLink19Description: https://datasheet.octopart.com:443/RMCF1206FT10K0-Stackpole-Electronics-datasheet-141193804.pdf?src-supplier=Master+Electronics; Pricing: 5000=0.00245, 10000=0.00241, 20000=0.00238, 40000=0.00234, 80000=0.0023 (USD); ComponentLink12URL: https://datasheet.octopart.com:443/RMCF0805FT10K0-Stackpole-Electronics-datasheet-8324226.pdf?src-supplier=Future+Electronics; ComponentLink13URL: https://datasheet.octopart.com:443/RMCF0805FT10K0-Stackpole-Electronics-datasheet-8088878.pdf?src-supplier=Future+Electronics; REACH SVHC: Yes; ComponentLink32Description: http://sigma.octopart.com:80/141158211/reach_statement/Stackpole-Electronics-RMCF1206FT10K0.pdf?src-supplier=Compliance+Statements; ComponentLink31URL: http://sigma.octopart.com:80/141158212/rohs_statement/Stackpole-Electronics-RMCF1206FT10K0.pdf?src-supplier=Compliance+Statements; Mounting Technology: Surface Mount; ComponentLink13Description: https://datasheet.octopart.com:443/RMCF0805FT10K0-Stackpole-Electronics-datasheet-8088878.pdf?src-supplier=Future+Electronics; ComponentLink9URL: https://datasheet.octopart.com:443/RMCF0805FT10K0-Stackpole-Electronics-datasheet-11546843.pdf?src-supplier=Arrow+Electronics; Voltage Rating: 150V; ComponentLink23URL: https://datasheet.octopart.com:443/RMCF1206FT10K0-Stackpole-Electronics-datasheet-28504820.pdf?src-supplier=Upverter; ComponentLink28URL: https://datasheet.octopart.com:443/RMCF1206FT10K0-Stackpole-Electronics-datasheet-8359789.pdf?src-supplier=Future+Electronics; ComponentLink18Description: https://datasheet.octopart.com:443/RMCF1206FT10K0-Stackpole-Electronics-datasheet-182148065.pdf?src-supplier=IHS; ComponentLink4URL: https://datasheet.octopart.com:443/RMCF0805FT10K0-Stackpole-Electronics-datasheet-12510902.pdf?src-supplier=Upverter; ComponentLink6URL: https://datasheet.octopart.com:443/RMCF0805FT10K0-Stackpole-Electronics-datasheet-62091608.pdf?src-supplier=Stackpole+Electronics; China RoHS: Non-Compliant; Design Item ID: 10R 1% 1/4W 1206; Category: Chip SMD Resistors; Case/Package: 1206; ComponentLink14Description: https://datasheet.octopart.com:443/RMCF0805FT10K0-Stackpole-Electronics-datasheet-5313682.pdf?src-supplier=Future+Electronics; RoHS: Compliant; ComponentLink29Description: https://datasheet.octopart.com:443/RMCF1206FT10K0-Stackpole-Electronics-datasheet-8324226.pdf?src-supplier=Future+Electronics; ComponentLink32URL: http://sigma.octopart.com:80/141158211/reach_statement/Stackpole-Electronics-RMCF1206FT10K0.pdf?src-supplier=Compliance+Statements; ComponentLink17Description: http://sigma.octopart.com:80/141158212/rohs_statement/Stackpole-Electronics-RMCF0805FT10K0.pdf?src-supplier=Compliance+Statements; Stock: 3420000; ComponentLink8Description: https://datasheet.octopart.com:443/RMCF0805FT10K0-Stackpole-Electronics-datasheet-154799224.pdf?src-supplier=Master+Electronics; ComponentLink1URL: https://datasheet.octopart.com:443/RMCF0805FT10K0-Stackpole-Electronics-datasheet-182148065.pdf?src-supplier=IHS; ComponentLink23Description: https://datasheet.octopart.com:443/RMCF1206FT10K0-Stackpole-Electronics-datasheet-28504820.pdf?src-supplier=Upverter; ComponentLink2URL: https://datasheet.octopart.com:443/RMCF0805FT10K0-Stackpole-Electronics-datasheet-12534581.pdf?src-supplier=Upverter; Radiation Hardening: No; ComponentLink24URL: https://datasheet.octopart.com:443/RMCF1206FT10K0-Stackpole-Electronics-datasheet-12534581.pdf?src-supplier=Stackpole+Electronics; Military Standard: Not; ComponentLink1Description: https://datasheet.octopart.com:443/RMCF0805FT10K0-Stackpole-Electronics-datasheet-182148065.pdf?src-supplier=IHS; ComponentLink9Description: https://datasheet.octopart.com:443/RMCF0805FT10K0-Stackpole-Electronics-datasheet-11546843.pdf?src-supplier=Arrow+Electronics; ComponentLink27URL: https://datasheet.octopart.com:443/RMCF1206FT10K0-Stackpole-Electronics-datasheet-11547379.pdf?src-supplier=Future+Electronics; ComponentLink25Description: https://datasheet.octopart.com:443/RMCF1206FT10K0-Stackpole-Electronics-datasheet-10788263.pdf?src-supplier=Stackpole+Electronics; Min Operating Temperature: -55°C; ComponentLink5Description: https://datasheet.octopart.com:443/RMCF0805FT10K0-Stackpole-Electronics-datasheet-141193804.pdf?src-supplier=Stackpole+Electronics; ComponentLink10URL: https://datasheet.octopart.com:443/RMCF0805FT10K0-Stackpole-Electronics-datasheet-11547379.pdf?src-supplier=Future+Electronics; Tolerance: 1%; Power Dissipation: 125mW; Number of Terminals: 2; ComponentLink2Description: https://datasheet.octopart.com:443/RMCF0805FT10K0-Stackpole-Electronics-datasheet-12534581.pdf?src-supplier=Upverter; ComponentLink26URL: https://datasheet.octopart.com:443/RMCF1206FT10K0-Stackpole-Electronics-datasheet-11546843.pdf?src-supplier=Arrow+Electronics; ComponentLink30Description: http://sigma.octopart.com:80/15940719/materials_sheet/Stackpole-Electronics-RMCF1206FT10K0.pdf?src-supplier=Compliance+Statements; Power Rating: 125mW; ComponentLink10Description: https://datasheet.octopart.com:443/RMCF0805FT10K0-Stackpole-Electronics-datasheet-11547379.pdf?src-supplier=Future+Electronics; ComponentLink24Description: https://datasheet.octopart.com:443/RMCF1206FT10K0-Stackpole-Electronics-datasheet-12534581.pdf?src-supplier=Stackpole+Electronics
R61 R70 = CMP-009-00648-1: Res Thick Film 0805 1K Ohm 1% 0.125W ±100ppm/°C Molded SMD Paper T/R; Manufacturer: Stackpole Electronics; Manufacturer Part Number: RMCF0805FT1K00; Power Dissipation: 125mW; Working Voltage: 150V; ComponentLink4Description: https://datasheet.octopart.com:443/RMCF0805FT10K0-Stackpole-Electronics-datasheet-12510902.pdf?src-supplier=Upverter; Tolerance: 1%; ComponentLink7Description: https://datasheet.octopart.com:443/RMCF0805FT10K0-Stackpole-Electronics-datasheet-10788263.pdf?src-supplier=Stackpole+Electronics; Category: Chip SMD Resistors; Pricing: 5000=0.00245, 10000=0.00241, 20000=0.00238, 40000=0.00234, 80000=0.0023 (USD); RoHS: Compliant; Packaging: Cut Tape (CT); Width: 1.25mm; ComponentLink12URL: https://datasheet.octopart.com:443/RMCF0805FT10K0-Stackpole-Electronics-datasheet-8324226.pdf?src-supplier=Future+Electronics; Temperature Coefficient: 100ppm/°C; Lifecycle Status: Production; Mounting Technology: Surface Mount; ComponentLink6Description: https://datasheet.octopart.com:443/RMCF0805FT10K0-Stackpole-Electronics-datasheet-62091608.pdf?src-supplier=Stackpole+Electronics; Number of Terminals: 2; ComponentLink1Description: https://datasheet.octopart.com:443/RMCF0805FT10K0-Stackpole-Electronics-datasheet-182148065.pdf?src-supplier=IHS; REACH SVHC: Yes; ComponentLink4URL: https://datasheet.octopart.com:443/RMCF0805FT10K0-Stackpole-Electronics-datasheet-12510902.pdf?src-supplier=Upverter; Power Rating: 125mW; Value: 1k; ComponentLink13URL: https://datasheet.octopart.com:443/RMCF0805FT10K0-Stackpole-Electronics-datasheet-8088878.pdf?src-supplier=Future+Electronics; ComponentLink10Description: https://datasheet.octopart.com:443/RMCF0805FT10K0-Stackpole-Electronics-datasheet-11547379.pdf?src-supplier=Future+Electronics; ComponentLink12Description: https://datasheet.octopart.com:443/RMCF0805FT10K0-Stackpole-Electronics-datasheet-8324226.pdf?src-supplier=Future+Electronics; ComponentLink2Description: https://datasheet.octopart.com:443/RMCF0805FT10K0-Stackpole-Electronics-datasheet-12534581.pdf?src-supplier=Upverter; Number of Terminations: 2; ComponentLink17URL: http://sigma.octopart.com:80/141158212/rohs_statement/Stackpole-Electronics-RMCF0805FT10K0.pdf?src-supplier=Compliance+Statements; Contact Plating: Tin; ComponentLink9URL: https://datasheet.octopart.com:443/RMCF0805FT10K0-Stackpole-Electronics-datasheet-11546843.pdf?src-supplier=Arrow+Electronics; ComponentLink17Description: http://sigma.octopart.com:80/141158212/rohs_statement/Stackpole-Electronics-RMCF0805FT10K0.pdf?src-supplier=Compliance+Statements; ComponentLink2URL: https://datasheet.octopart.com:443/RMCF0805FT10K0-Stackpole-Electronics-datasheet-12534581.pdf?src-supplier=Upverter; Case Code (Metric): 2012; ComponentLink8Description: https://datasheet.octopart.com:443/RMCF0805FT10K0-Stackpole-Electronics-datasheet-154799224.pdf?src-supplier=Master+Electronics; ComponentLink11Description: https://datasheet.octopart.com:443/RMCF0805FT10K0-Stackpole-Electronics-datasheet-8359789.pdf?src-supplier=Future+Electronics; ComponentLink5Description: https://datasheet.octopart.com:443/RMCF0805FT10K0-Stackpole-Electronics-datasheet-141193804.pdf?src-supplier=Stackpole+Electronics; ComponentLink11URL: https://datasheet.octopart.com:443/RMCF0805FT10K0-Stackpole-Electronics-datasheet-8359789.pdf?src-supplier=Future+Electronics; Height: 500µm; ComponentLink1URL: https://datasheet.octopart.com:443/RMCF0805FT10K0-Stackpole-Electronics-datasheet-182148065.pdf?src-supplier=IHS; Length: 2mm; ComponentLink16Description: http://sigma.octopart.com:80/141158211/reach_statement/Stackpole-Electronics-RMCF0805FT10K0.pdf?src-supplier=Compliance+Statements; ComponentLink6URL: https://datasheet.octopart.com:443/RMCF0805FT10K0-Stackpole-Electronics-datasheet-62091608.pdf?src-supplier=Stackpole+Electronics; Schedule B: 8533210045, 8533210045; ComponentLink14URL: https://datasheet.octopart.com:443/RMCF0805FT10K0-Stackpole-Electronics-datasheet-5313682.pdf?src-supplier=Future+Electronics; Stock: 3420000; ComponentLink14Description: https://datasheet.octopart.com:443/RMCF0805FT10K0-Stackpole-Electronics-datasheet-5313682.pdf?src-supplier=Future+Electronics; Features: Automotive AEC-Q200; China RoHS: Non-Compliant; ComponentLink13Description: https://datasheet.octopart.com:443/RMCF0805FT10K0-Stackpole-Electronics-datasheet-8088878.pdf?src-supplier=Future+Electronics; Voltage Rating: 150V; Radiation Hardening: No; Source: MasterLibrary_SCH.SchLib; ComponentLink8URL: https://datasheet.octopart.com:443/RMCF0805FT10K0-Stackpole-Electronics-datasheet-154799224.pdf?src-supplier=Master+Electronics; Max Operating Temperature: 155°C; Design Item ID: 1K 1% 1/8W 0805; ComponentLink15Description: http://sigma.octopart.com:80/15940719/materials_sheet/Stackpole-Electronics-RMCF0805FT10K0.pdf?src-supplier=Compliance+Statements; ComponentLink5URL: https://datasheet.octopart.com:443/RMCF0805FT10K0-Stackpole-Electronics-datasheet-141193804.pdf?src-supplier=Stackpole+Electronics; ComponentLink15URL: http://sigma.octopart.com:80/15940719/materials_sheet/Stackpole-Electronics-RMCF0805FT10K0.pdf?src-supplier=Compliance+Statements; Lead Free: Lead Free; Case/Package: 0805; Max Power Dissipation: 125mW; ComponentLink10URL: https://datasheet.octopart.com:443/RMCF0805FT10K0-Stackpole-Electronics-datasheet-11547379.pdf?src-supplier=Future+Electronics; ComponentLink7URL: https://datasheet.octopart.com:443/RMCF0805FT10K0-Stackpole-Electronics-datasheet-10788263.pdf?src-supplier=Stackpole+Electronics; Min Operating Temperature: -55°C; ComponentLink9Description: https://datasheet.octopart.com:443/RMCF0805FT10K0-Stackpole-Electronics-datasheet-11546843.pdf?src-supplier=Arrow+Electronics; Depth: 1.25mm; Military Standard: Not; ComponentLink16URL: http://sigma.octopart.com:80/141158211/reach_statement/Stackpole-Electronics-RMCF0805FT10K0.pdf?src-supplier=Compliance+Statements; ComponentLink3URL: https://datasheet.octopart.com:443/RMCF0805FT10K0-Stackpole-Electronics-datasheet-28504820.pdf?src-supplier=Upverter; ComponentLink3Description: https://datasheet.octopart.com:443/RMCF0805FT10K0-Stackpole-Electronics-datasheet-28504820.pdf?src-supplier=Upverter; Composition: Thick Film
TP5-TP18 = CMP-002-00584-1
U2 U3 = CMP-309-000001-3: Gate Driver Reinforced Isolated Single Channel 10A 5.7kV 16-Pin SOIC T/R Automotive; Manufacturer Lifecycle Status: ACTIVE; Manufacturer: Texas Instruments; Length: 10.3mm; Category: Integrated Circuits (ICs); Case/Package: SOIC; Thickness: 2.35mm; Height: 2.65mm; Width: 7.5mm; Manufacturer Part Number: UCC21750QDWRQ1; RoHS: Compliant; Lifecycle Status: Production; Pins: 16; Schedule B: 8542390000, 8542390000; Number of Pins: 16